# Altium schematic sheet Ref Volt.SchDoc
size A
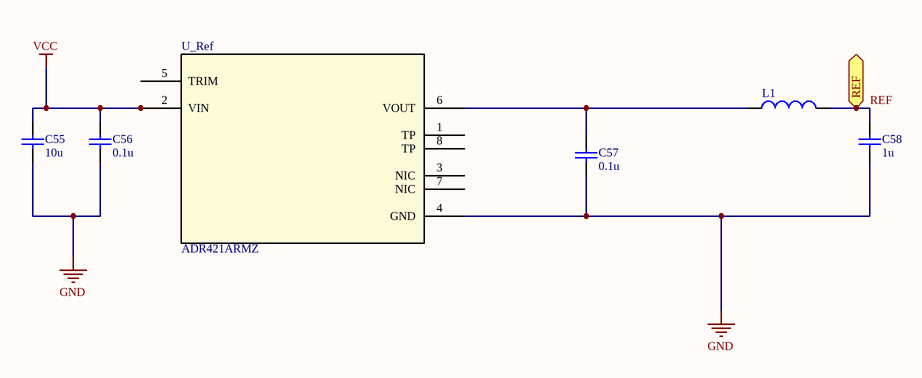
[diagram p0: Ref Volt.SchDoc]

## Parts
C55  value 10u  [0805]  (hidden comment: C0805)
C56  value 0.1u  [0603]  (hidden comment: C0603)
C57  value 0.1u  [0603]  (hidden comment: C0603)
C58  value 1u  [0805]  (hidden comment: C0805)
L1  Inductor  [INDC1608L]  (value not drawn)
U_Ref  ADR421ARMZ  [RM_8]

## Ports
REF

## Nets
GND: C55.1 C56.1 C57.1 C58.2 U_Ref.4(GND)
VCC: C55.2 C56.2 U_Ref.2(VIN)
REF: C58.1 L1.2 ; port REF
NetC57_2: C57.2 L1.1 U_Ref.6(VOUT)

Not connected (* = marked no-connect by the designer): U_Ref 1(TP) 3(NIC) 5(TRIM) 7(NIC) 8(TP)

## Library data of the parts
C55 C58 = C0805: Ceramic Chip Capacitor - Standard; Note: Footprint corresponds to dimensions for bulk cassette packaging. This case size has tightened tolerances.; Published: 17-Jul-2002; LatestRevisionDate: 19-Mar-2004; LatestRevisionNote: Silkscreen size reduced.; DatasheetDocument: Mar-2001; PackageDocument: Mar-2001; PackageReference: 0805; Publisher: Altium Limited; Code_JEITA: 0805; Code_IPC: 2012[0805]; ComponentLink1Description: Manufacturer Link; ComponentLink1URL: http://www.kemet.com/; ComponentLink2Description: Datasheet; ComponentLink2URL: http://www.kemet.com/kemet/web/homepage/kechome.nsf/vapubfilesname/F3102TA.pdf/$file/F3102TA.pdf
C56 C57 = C0603: Ceramic Chip Capacitor - Standard; Note: Footprint corresponds to dimensions for bulk cassette packaging. This case size has tightened tolerances.; Published: 17-Jul-2002; LatestRevisionDate: 19-Mar-2004; LatestRevisionNote: Silkscreen size reduced.; DatasheetDocument: Mar-2001; PackageDocument: Mar-2001; PackageReference: 0603; Publisher: Altium Limited; Code_JEITA: 0603; Code_IPC: 1608 [0603]; ComponentLink1Description: Manufacturer Link; ComponentLink1URL: http://www.kemet.com/; ComponentLink2Description: Datasheet; ComponentLink2URL: http://www.kemet.com/kemet/web/homepage/kechome.nsf/vapubfilesname/F3102TA.pdf/$file/F3102TA.pdf
L1 = Inductor: Code_IEC: 1005; Value: 10mH; Published: 8-Jun-2000; LatestRevisionDate: 29-May-2009; LatestRevisionNote: IPC-7351 Footprint Added.; PackageReference: 0402-A; Publisher: Altium Limited; PackageDescription: Chip Inductor; Code_JEITA: 0402
U_Ref = ADR421ARMZ: Imported; Manufacturer_Part_Number: ADR421ARMZ; Vendor: Vendor; Value: Value; Type: Type; RefDes: Refdes